# EAGLE design Nixie Wrist Clock V1 (EAGLE 9.5.1)

## Sheet 1 of 5
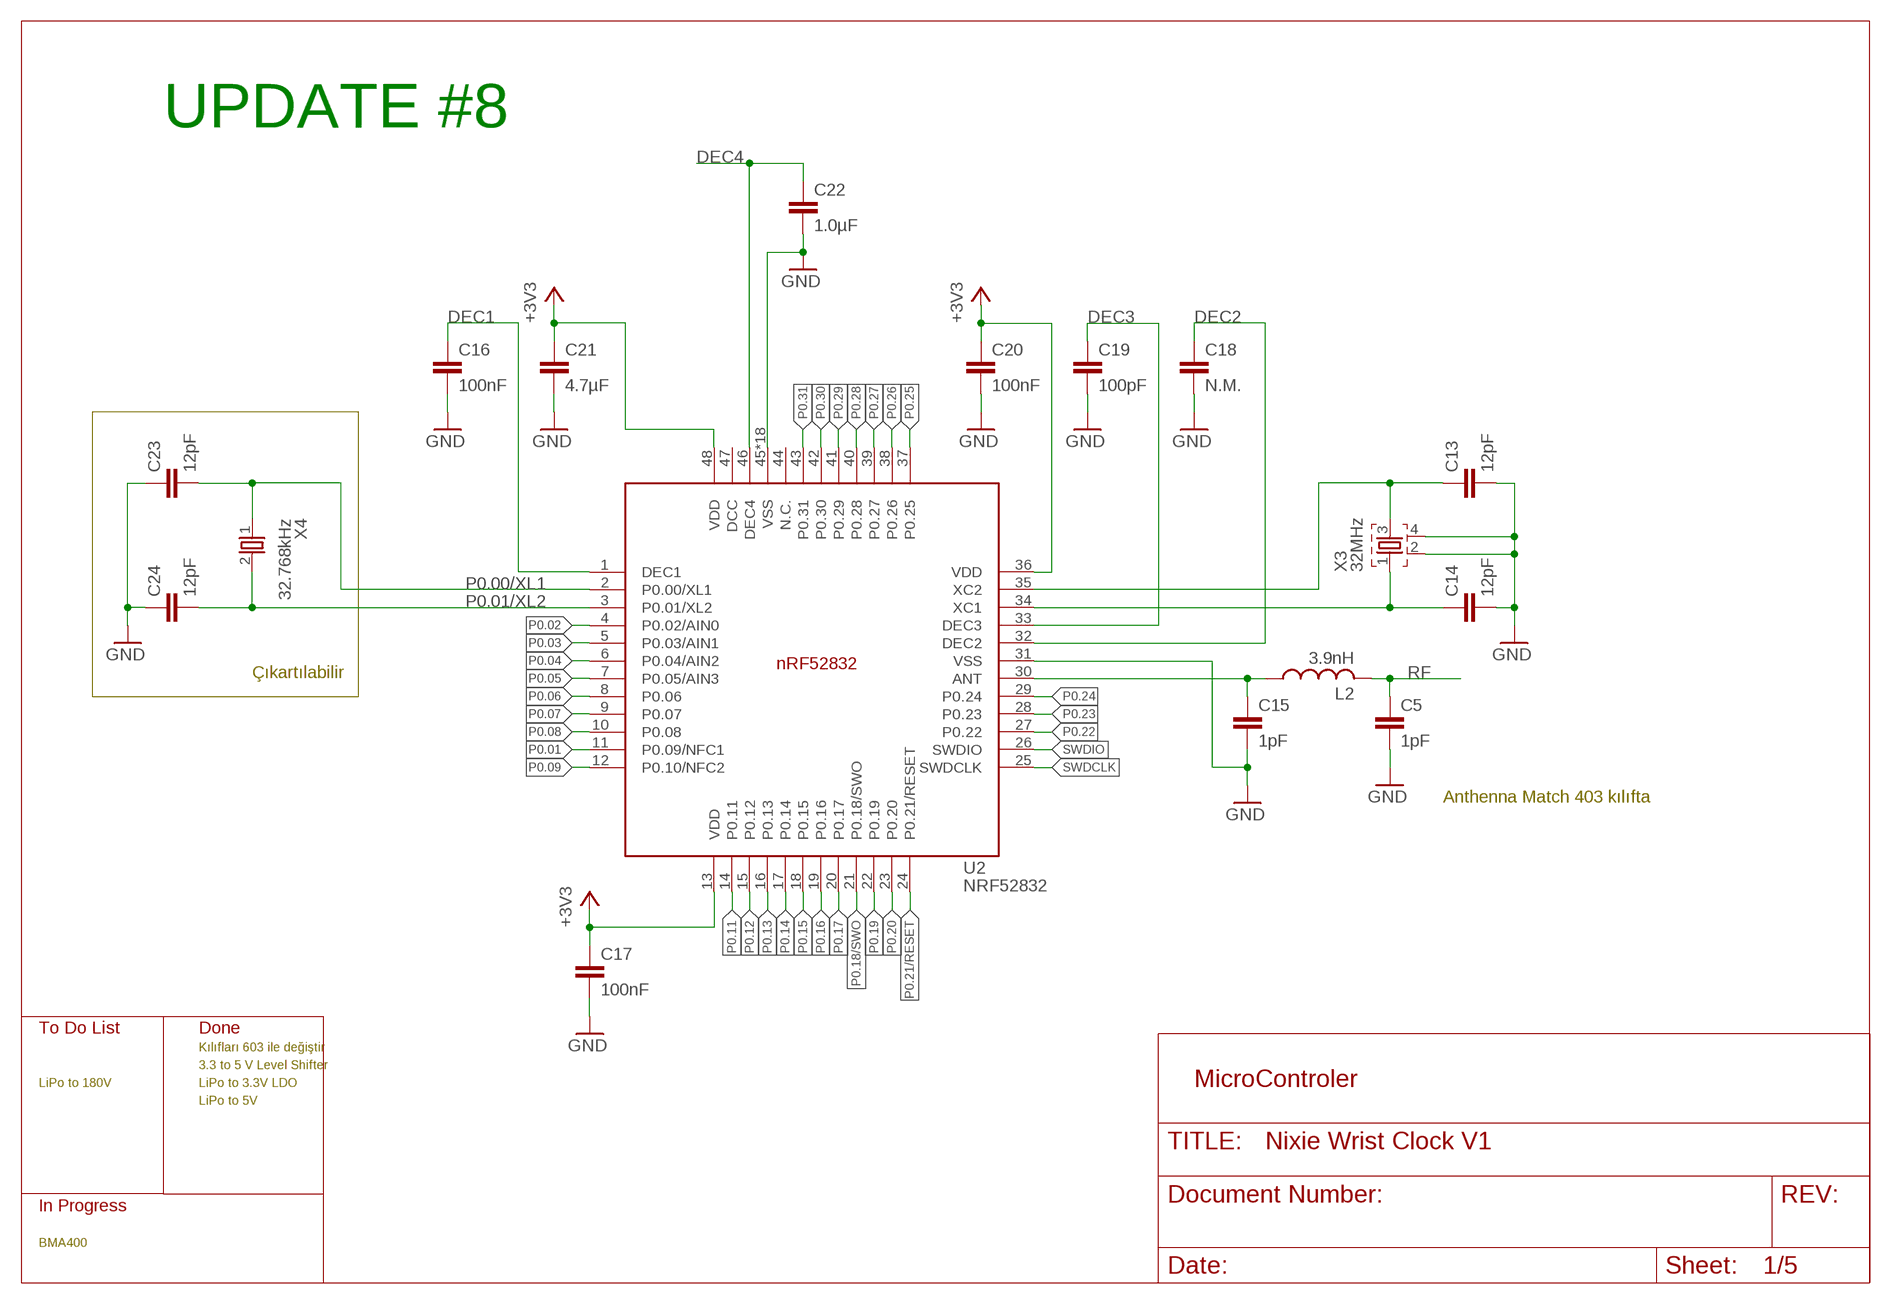
[diagram p0: schematic, sheet 1]

### Parts
C5  1pF  CAPACITOR_0402_N  [RESC0402_N]
C13  12pF  CAPACITOR_0603_N  [RESC0603_N]
C14  12pF  CAPACITOR_0603_N  [RESC0603_N]
C15  1pF  CAPACITOR_0402_N  [RESC0402_N]
C16  100nF  CAPACITOR_0603_N  [RESC0603_N]
C17  100nF  CAPACITOR_0603_N  [RESC0603_N]
C18  N.M.  CAPACITOR_0603_N  [RESC0603_N]
C19  100pF  CAPACITOR_0603_N  [RESC0603_N]
C20  100nF  CAPACITOR_0603_N  [RESC0603_N]
C21  4.7µF  CAPACITOR_0603_N  [RESC0603_N]
C22  1.0µF  CAPACITOR_0603_N  [RESC0603_N]
C23  12pF  CAPACITOR_0603_N  [RESC0603_N]
C24  12pF  CAPACITOR_0603_N  [RESC0603_N]
L2  3.9nH  INDUCTOR_0402_N  [RESC0402_N]
U2  NRF52832  [QFN40P600X600X90-48_N]
X3  32MHz  XTAL_32MHZ  [BT-XTAL_2016_N]
X4  32.768kHz  XTAL_32KHZ  [XTAL_3215_N]

### Nets
+3V3: C17.1 C20.1 C21.1 U2.13(VDD) U2.36(VDD) U2.48(VDD) ; also sheet 2,3,4
ANT1: C15.1 L2.1 U2.30(ANT)
DEC1: C16.1 U2.1(DEC1)
DEC2: C18.1 U2.32(DEC2)
DEC3: C19.1 U2.33(DEC3)
DEC4: C22.1 U2.46(DEC4)
GND: C5.2 C13.2 C14.2 C15.2 C16.2 C17.2 C18.2 C19.2 C20.2 C21.2 C22.2 C23.1 C24.1 U2.31(VSS) U2.45(VSS) U2.PAD(VSS) U2.PAD@VIA01(VSS) U2.PAD@VIA02(VSS) U2.PAD@VIA03(VSS) U2.PAD@VIA04(VSS) U2.PAD@VIA05(VSS) U2.PAD@VIA06(VSS) U2.PAD@VIA07(VSS) U2.PAD@VIA08(VSS) U2.PAD@VIA09(VSS) U2.PAD@VIA10(VSS) U2.PAD@VIA11(VSS) U2.PAD@VIA12(VSS) U2.PAD@VIA13(VSS) U2.PAD@VIA14(VSS) U2.PAD@VIA15(VSS) U2.PAD@VIA16(VSS) X3.2 X3.4 ; also sheet 2,3,4,5
N$1: C13.1 U2.35(XC2) X3.3
P0.00/XL1: C23.2 U2.2(P0.00/XL1) X4.1
P0.01: U2.11(P0.09/NFC1)
P0.01/XL2: C24.2 U2.3(P0.01/XL2) X4.2
P0.02: U2.4(P0.02/AIN0)
P0.03: U2.5(P0.03/AIN1)
P0.04: U2.6(P0.04/AIN2)
P0.05: U2.7(P0.05/AIN3)
P0.06: U2.8(P0.06)
P0.07: U2.9(P0.07)
P0.08: U2.10(P0.08)
P0.09: U2.12(P0.10/NFC2)
P0.11: U2.14(P0.11)
P0.12: U2.15(P0.12)
P0.13: U2.16(P0.13)
P0.14: U2.17(P0.14)
P0.15: U2.18(P0.15)
P0.16: U2.19(P0.16)
P0.17: U2.20(P0.17)
P0.18/SWO: U2.21(P0.18/SWO)
P0.19: U2.22(P0.19)
P0.20: U2.23(P0.20)
P0.21/RESET: U2.24(P0.21/RESET)
P0.22: U2.27(P0.22)
P0.23: U2.28(P0.23)
P0.24: U2.29(P0.24)
P0.25: U2.37(P0.25)
P0.26: U2.38(P0.26)
P0.27: U2.39(P0.27)
P0.28: U2.40(P0.28)
P0.29: U2.41(P0.29)
P0.30: U2.42(P0.30)
P0.31: U2.43(P0.31)
RF: C5.1 L2.2
SWDCLK: U2.25(SWDCLK)
SWDIO: U2.26(SWDIO)
X2: C14.1 U2.34(XC1) X3.1
Unconnected: U2.44(N.C.) U2.47(DCC)

### Notes on the sheet
- UPDATE #8
- Çıkartılabilir
- Anthenna Match 403 kılıfta
- To Do List | Done
- Kılıfları 603 ile değiştir
- 3.3 to 5 V Level Shifter
- LiPo to 180V | LiPo to 3.3V LDO | MicroControler
- LiPo to 5V
- In Progress
- BMA400

## Sheet 2 of 5
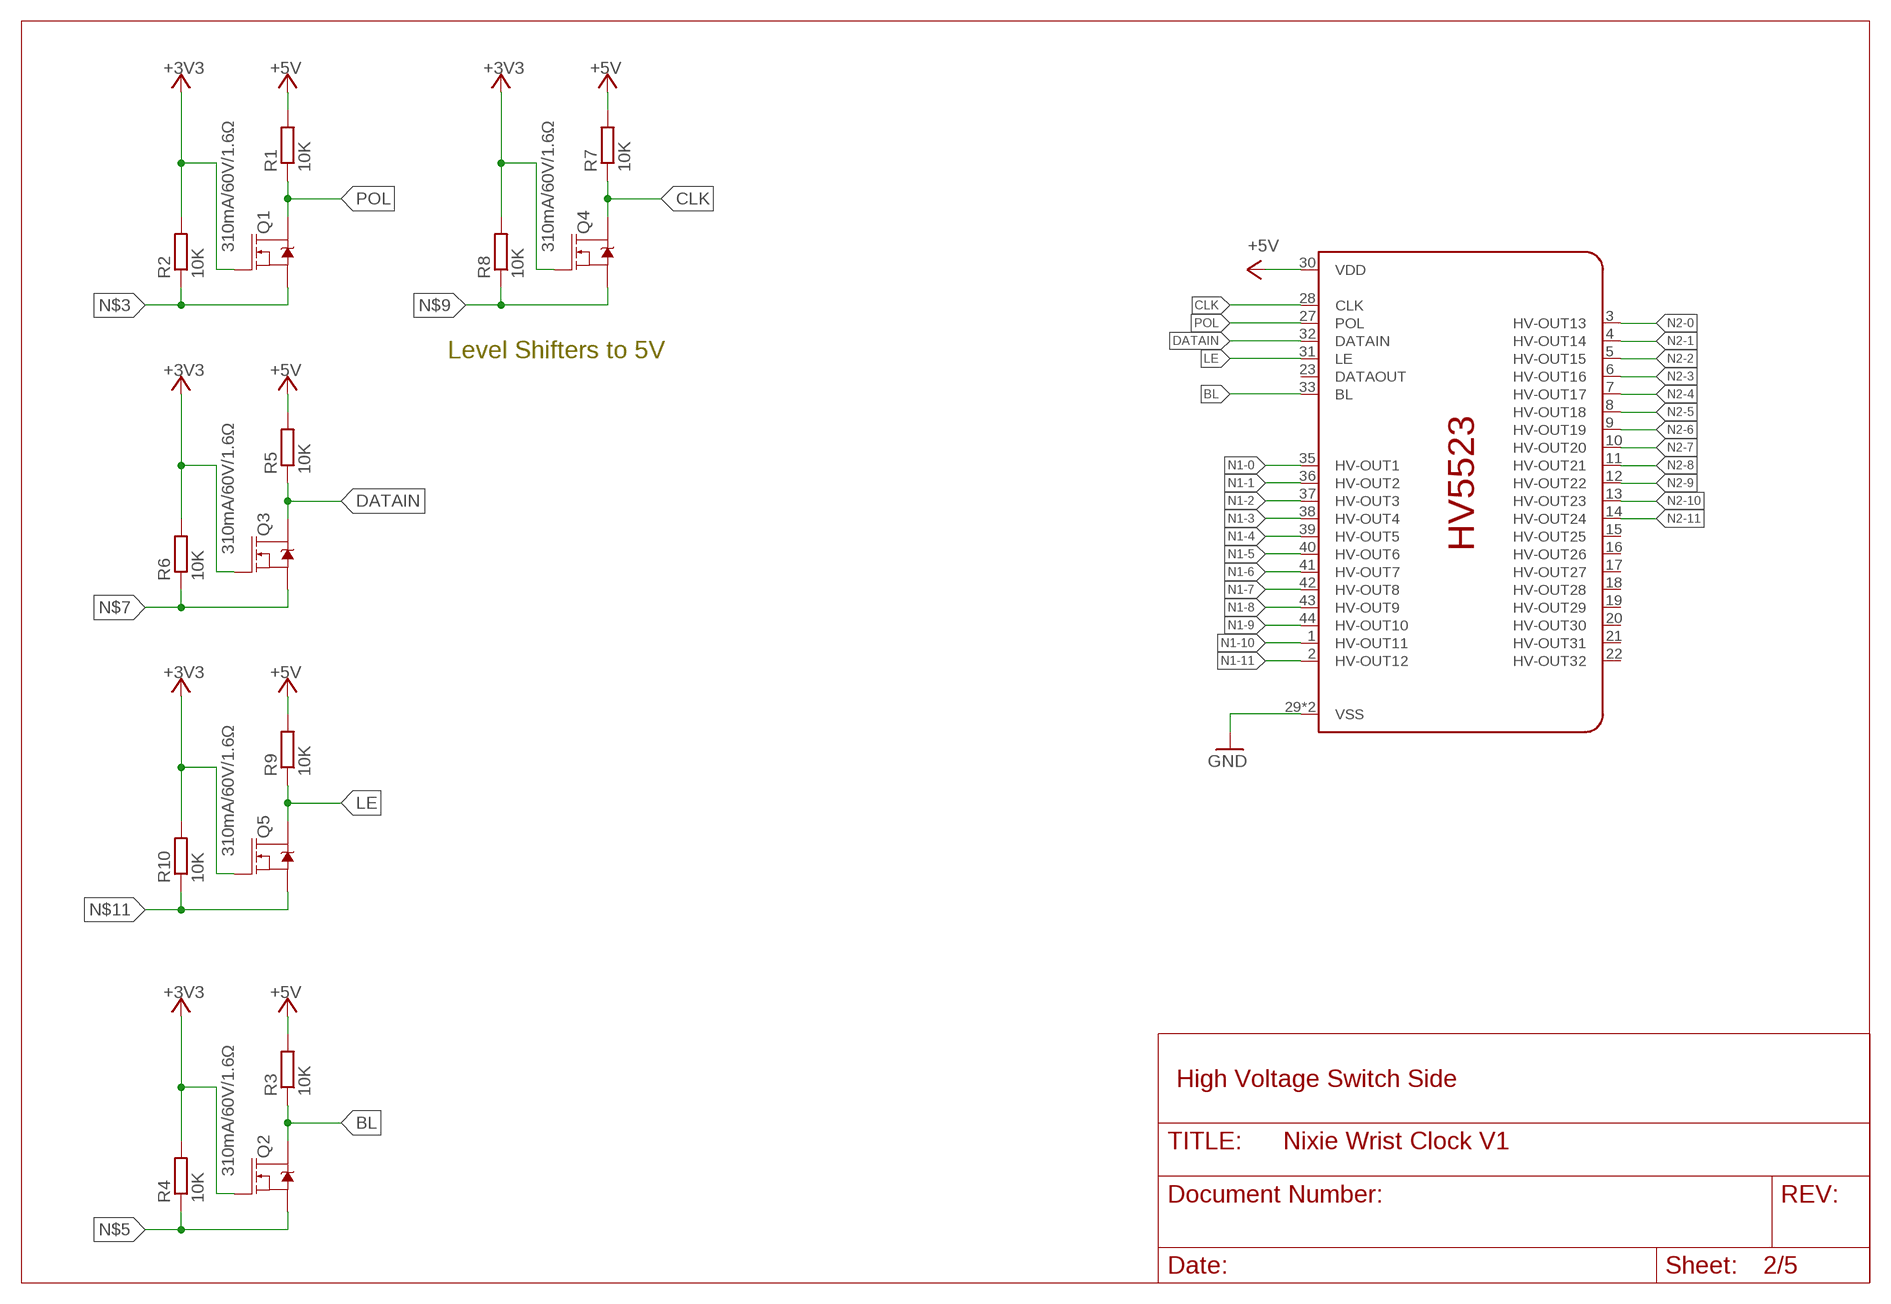
[diagram p1: schematic, sheet 2]

### Parts
Q1  310mA/60V/1.6Ω  MOSFET-NCH-2N7002PW  [SOT323]
Q2  310mA/60V/1.6Ω  MOSFET-NCH-2N7002PW  [SOT323]
Q3  310mA/60V/1.6Ω  MOSFET-NCH-2N7002PW  [SOT323]
Q4  310mA/60V/1.6Ω  MOSFET-NCH-2N7002PW  [SOT323]
Q5  310mA/60V/1.6Ω  MOSFET-NCH-2N7002PW  [SOT323]
R1  10K  R-EU_R0603  [R0603]
R2  10K  R-EU_R0603  [R0603]
R3  10K  R-EU_R0603  [R0603]
R4  10K  R-EU_R0603  [R0603]
R5  10K  R-EU_R0603  [R0603]
R6  10K  R-EU_R0603  [R0603]
R7  10K  R-EU_R0603  [R0603]
R8  10K  R-EU_R0603  [R0603]
R9  10K  R-EU_R0603  [R0603]
R10  10K  R-EU_R0603  [R0603]
U$2  HV5523K7  [QFN50P707X707X80-45T515]

### Nets
+3V3: Q1.1(G) Q2.1(G) Q3.1(G) Q4.1(G) Q5.1(G) R2.2 R4.2 R6.2 R8.2 R10.2 ; also sheet 1,3,4
+5V: R1.2 R3.2 R5.2 R7.2 R9.2 U$2.30(VDD) ; also sheet 5
BL: Q2.3(D) R3.1 U$2.33(BL)
CLK: Q4.3(D) R7.1 U$2.28(CLK)
DATAIN: Q3.3(D) R5.1 U$2.32(DATAIN)
GND: U$2.29(VSS) U$2.45(VSS) ; also sheet 1,3,4,5
LE: Q5.3(D) R9.1 U$2.31(LE)
N1-0: U$2.35(HV-OUT1)
N1-1: U$2.36(HV-OUT2)
N1-2: U$2.37(HV-OUT3)
N1-3: U$2.38(HV-OUT4)
N1-4: U$2.39(HV-OUT5)
N1-5: U$2.40(HV-OUT6)
N1-6: U$2.41(HV-OUT7)
N1-7: U$2.42(HV-OUT8)
N1-8: U$2.43(HV-OUT9)
N1-9: U$2.44(HV-OUT10)
N1-10: U$2.1(HV-OUT11)
N1-11: U$2.2(HV-OUT12)
N2-0: U$2.3(HV-OUT13)
N2-1: U$2.4(HV-OUT14)
N2-2: U$2.5(HV-OUT15)
N2-3: U$2.6(HV-OUT16)
N2-4: U$2.7(HV-OUT17)
N2-5: U$2.8(HV-OUT18)
N2-6: U$2.9(HV-OUT19)
N2-7: U$2.10(HV-OUT20)
N2-8: U$2.11(HV-OUT21)
N2-9: U$2.12(HV-OUT22)
N2-10: U$2.13(HV-OUT23)
N2-11: U$2.14(HV-OUT24)
N$3: Q1.2(S) R2.1
N$5: Q2.2(S) R4.1
N$7: Q3.2(S) R6.1
N$9: Q4.2(S) R8.1
N$11: Q5.2(S) R10.1
POL: Q1.3(D) R1.1 U$2.27(POL)
Unconnected: U$2.15(HV-OUT25) U$2.16(HV-OUT26) U$2.17(HV-OUT27) U$2.18(HV-OUT28) U$2.19(HV-OUT29) U$2.20(HV-OUT30) U$2.21(HV-OUT31) U$2.22(HV-OUT32) U$2.23(DATAOUT)

### Notes on the sheet
- Level Shifters to 5V
- High Voltage Switch Side

## Sheet 3 of 5
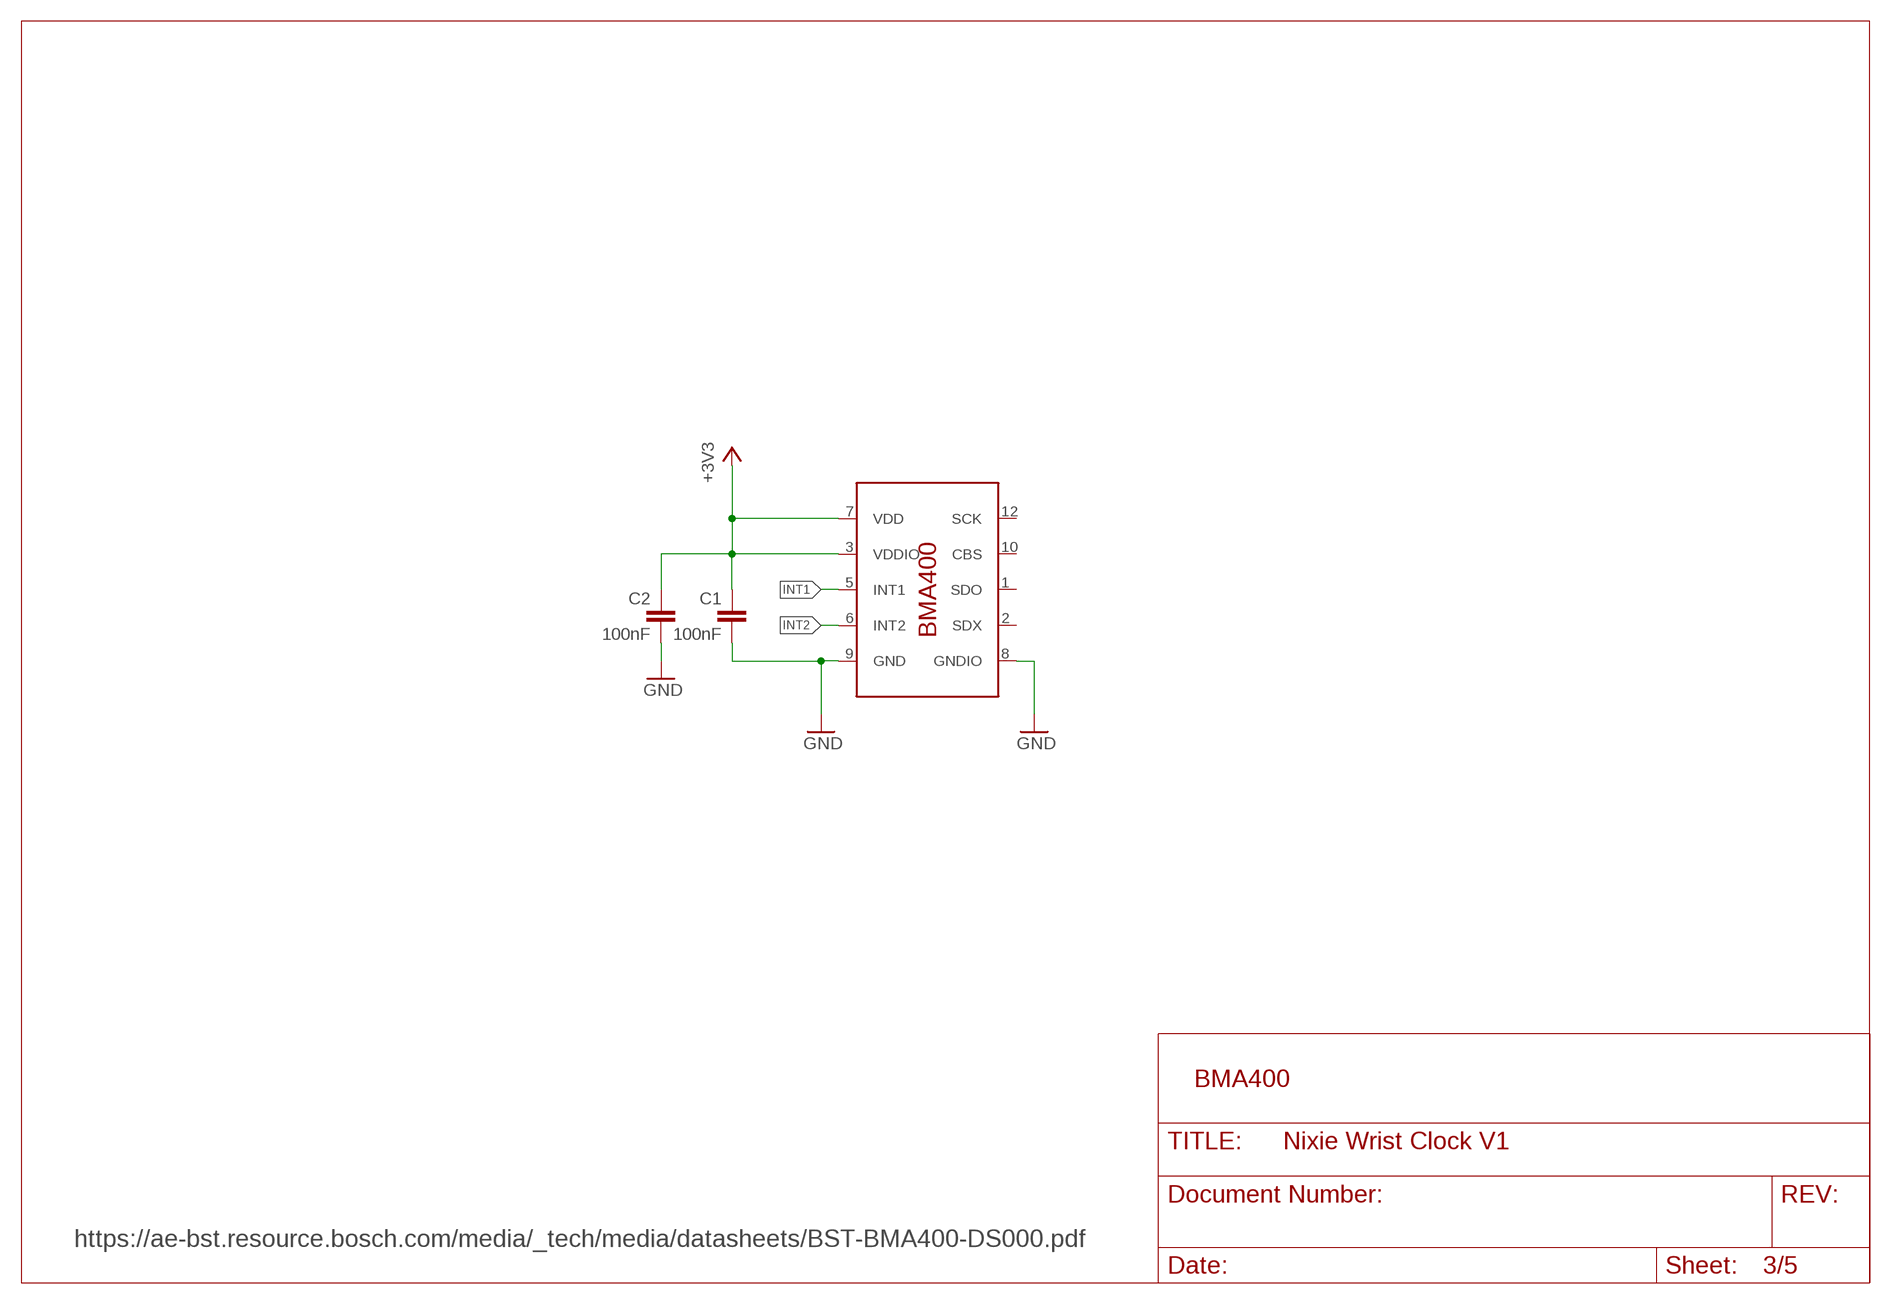
[diagram p2: schematic, sheet 3]

### Parts
C1  100nF  C-EUC0603K  [C0603K]
C2  100nF  C-EUC0603K  [C0603K]
U$1  BMA400  [LGA-12]

### Nets
+3V3: C1.2 C2.1 U$1.3(VDDIO) U$1.7(VDD) ; also sheet 1,2,4
GND: C1.1 C2.2 U$1.8(GNDIO) U$1.9(GND) ; also sheet 1,2,4,5
INT1: U$1.5(INT1)
INT2: U$1.6(INT2)
Unconnected: U$1.1(SDO) U$1.2(SDX) U$1.10(CBS) U$1.12(SCK)

### Notes on the sheet
- BMA400
- https://ae-bst.resource.bosch.com/media/_tech/media/datasheets/BST-BMA400-DS000.pdf

## Sheet 4 of 5
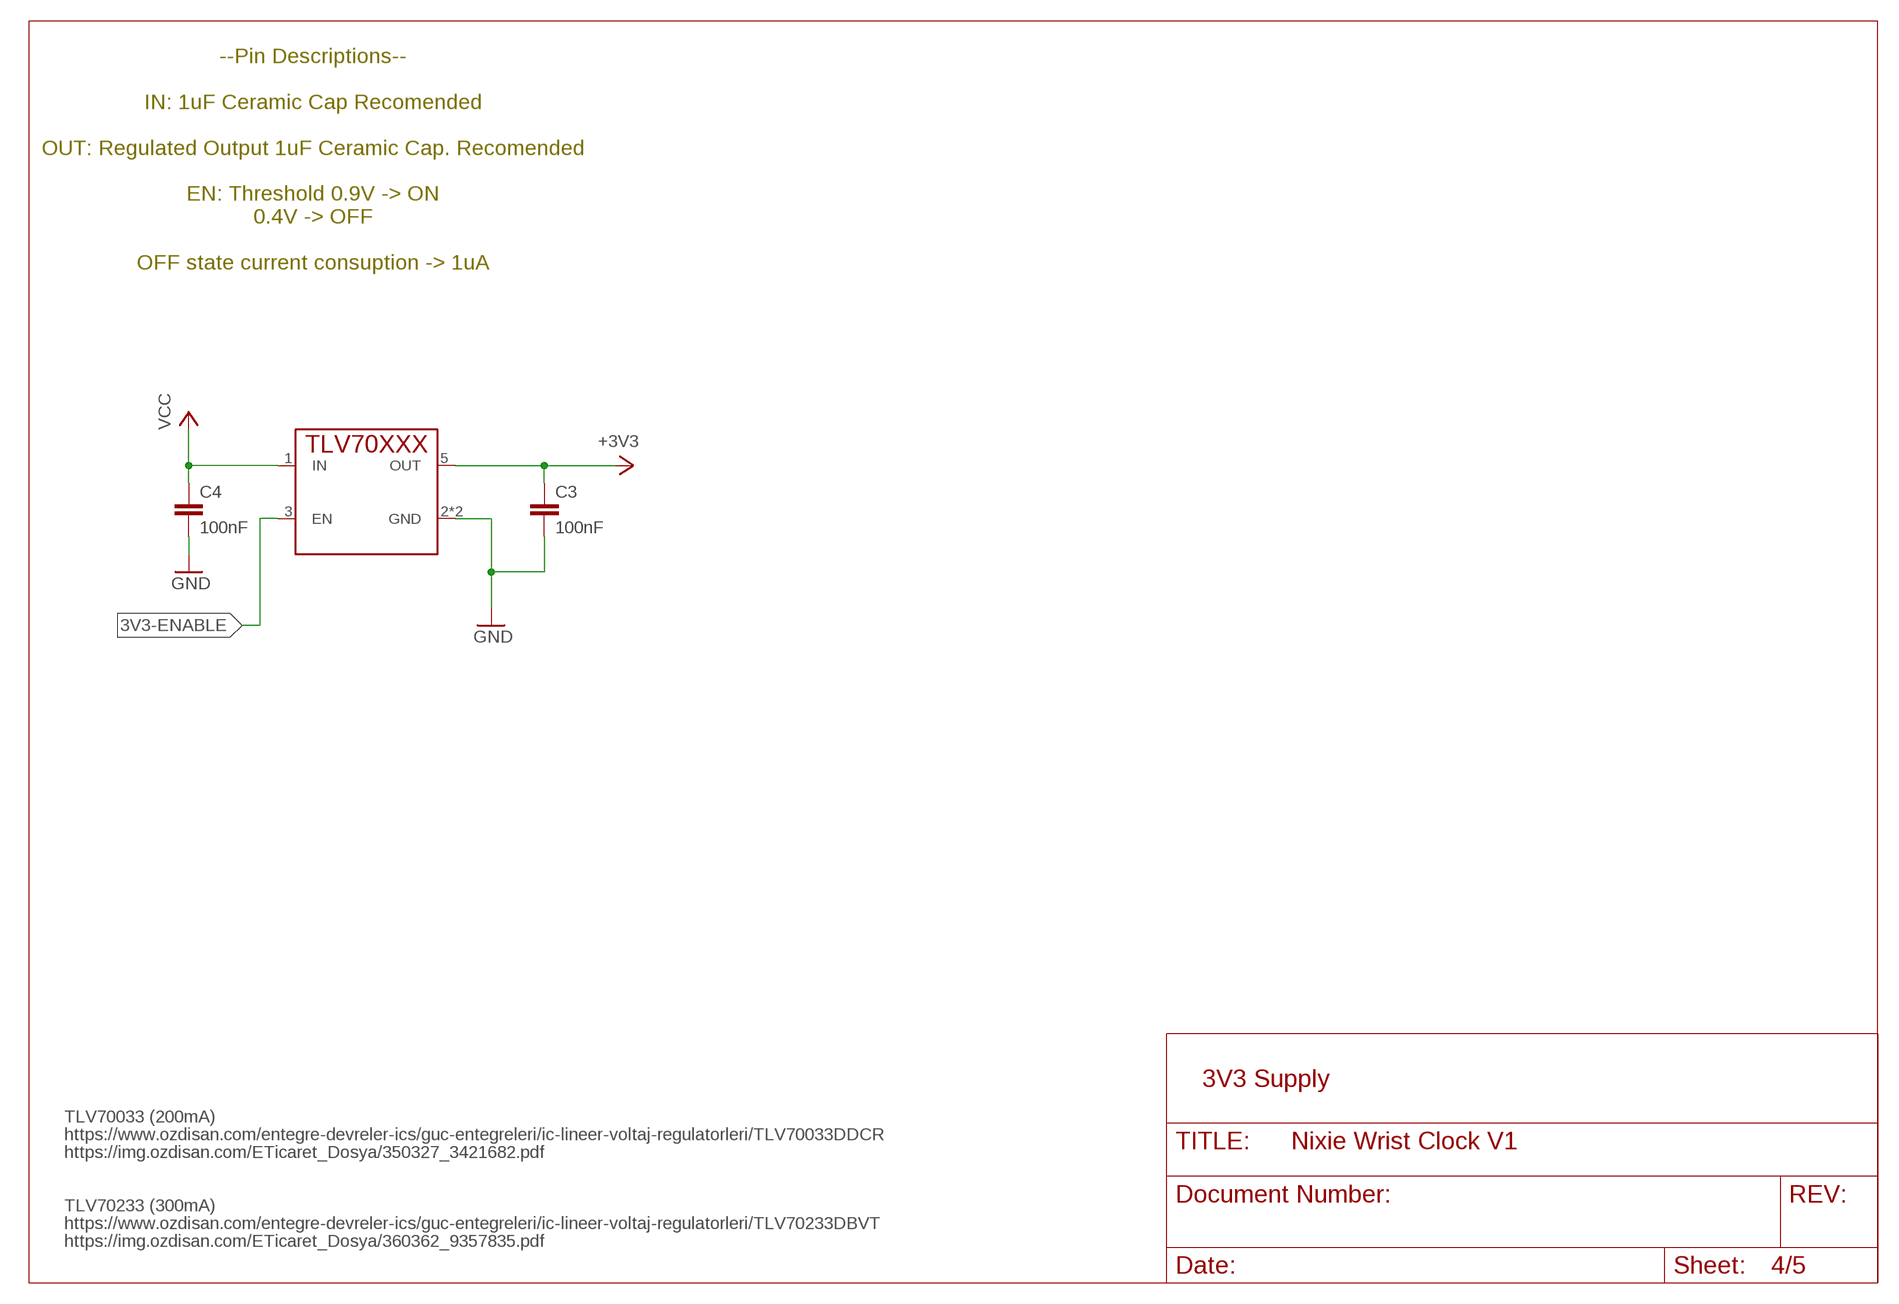
[diagram p3: schematic, sheet 4]

### Parts
C3  100nF  CAPACITOR_0603_N  [RESC0603_N]
C4  100nF  CAPACITOR_0603_N  [RESC0603_N]
U$3  TLV70233SOT23-5  [SOT23-5]

### Nets
3V3-ENABLE: U$3.3(EN)
+3V3: C3.1 U$3.5(OUT) ; also sheet 1,2,3
GND: C3.2 C4.2 U$3.2(GND) U$3.4(GND) ; also sheet 1,2,3,5
VCC: C4.1 U$3.1(IN) ; also sheet 5

### Notes on the sheet
- --Pin Descriptions--
  
  IN: 1uF Ceramic Cap Recomended
  
  OUT: Regulated Output 1uF Ceramic Cap. Recomended
  
  EN: Threshold 0.9V -> ON
  0.4V -> OFF
  
  OFF state current consuption -> 1uA
- 3V3 Supply
- TLV70033 (200mA)
- https://www.ozdisan.com/entegre-devreler-ics/guc-entegreleri/ic-lineer-voltaj-regulatorleri/TLV70033DDCR
- https://img.ozdisan.com/ETicaret_Dosya/350327_3421682.pdf
- TLV70233 (300mA)
- https://www.ozdisan.com/entegre-devreler-ics/guc-entegreleri/ic-lineer-voltaj-regulatorleri/TLV70233DBVT
- https://img.ozdisan.com/ETicaret_Dosya/360362_9357835.pdf

## Sheet 5 of 5
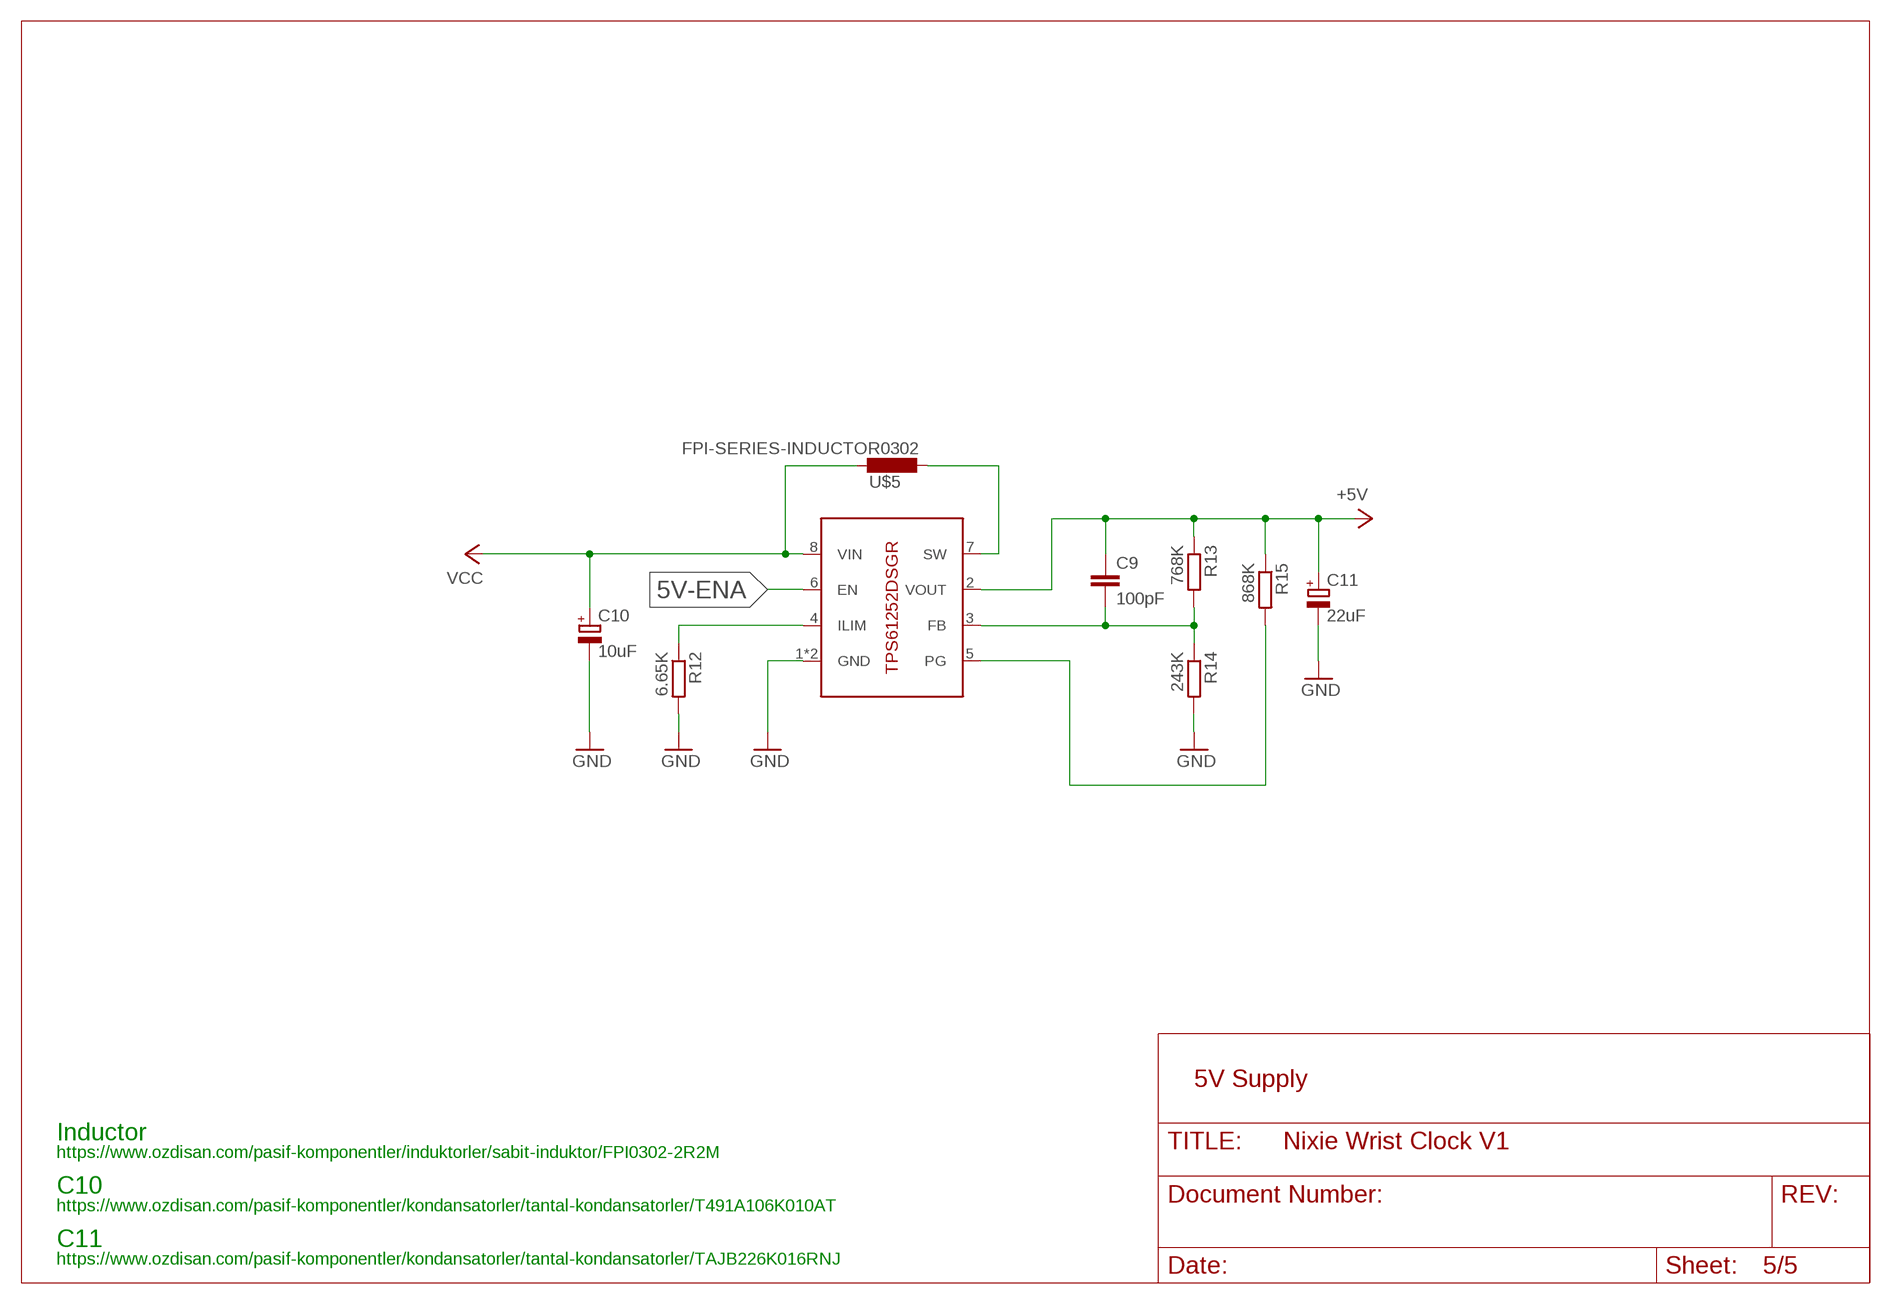
[diagram p4: schematic, sheet 5]

### Parts
C9  100pF  CAPACITOR_0603_N  [RESC0603_N]
C10  10uF  CPOL-EUSMCA  [SMC_A]
C11  22uF  CPOL-EUSMCB  [SMC_B]
R12  6.65K  R-EU_R0603  [R0603]
R13  768K  R-EU_R0603  [R0603]
R14  243K  R-EU_R0603  [R0603]
R15  868K  R-EU_R0603  [R0603]
U$4  TPS61252DSGR  [WSON-8-PAD]
U$5  FPI-SERIES-INDUCTOR0302  [FPI-0302]

### Nets
5V-ENA: U$4.6(EN)
+5V: C9.1 C11.+ R13.1 R15.1 U$4.2(VOUT) ; also sheet 2
GND: C10.- C11.- R12.2 R14.2 U$4.1(GND) U$4.PAD(GND) ; also sheet 1,2,3,4
N$6: U$4.7(SW) U$5.P$2
N$8: R12.1 U$4.4(ILIM)
N$10: R15.2 U$4.5(PG)
N$14: C9.2 R13.2 R14.1 U$4.3(FB)
VCC: C10.+ U$4.8(VIN) U$5.P$1 ; also sheet 4

### Notes on the sheet
- 5V Supply
- Inductor
- https://www.ozdisan.com/pasif-komponentler/induktorler/sabit-induktor/FPI0302-2R2M
- C10
- https://www.ozdisan.com/pasif-komponentler/kondansatorler/tantal-kondansatorler/T491A106K010AT
- C11
- https://www.ozdisan.com/pasif-komponentler/kondansatorler/tantal-kondansatorler/TAJB226K016RNJ

## Library data of the parts
C1 C2 = rcl:C-EU: CAPACITOR, European symbol; SPICEPREFIX: C
C3-C5 C9 C13-C24 = Nordic_nRF:CAPACITOR: Generic chip capacitor
C10 C11 = rcl:CPOL-EU: POLARIZED CAPACITOR, European symbol; SPICEPREFIX: C
L2 = Nordic_nRF:INDUCTOR: Generic chip inductor
Q1-Q5 = SparkFun-DiscreteSemi:MOSFET-NCH: N-channel MOSFETs Voltage controlled devices that allow control of high current outputs. SparkFun Products: SparkFun OpenScale <https://www.sparkfun.com/products/13261> SparkFun Digital Sandbox <https://www.sparkfun.com/products/12651> SparkFun Monster Moto Shield <https://www.sparkfun.com/products/10182> SparkFun MOSFET Power Controller <https://www.sparkfun.com/products/11214>; PROD_ID: TRANS-11151
R1-R10 R12-R15 = rcl:R-EU_: RESISTOR, European symbol; SPICEPREFIX: R
U2 = Nordic_nRF:NRF52832: nRF52832 Features Single chip, highly flexible, 2.4 GHz multi-protocol SoC 32-bit ARM Cortex-M4F Processor 1.7v to 3.6v operation 512kB flash + 64kB RAM Supports concurrent Bluetooth Smart/ANT protocol operation On-chip NFC tag for Out-of-Band (OOB) pairing Up to +4dBm output power -96dBm sensitivity, Bluetooth Smart Thread safe and run-time protected Event driven API On air compatible with nRF24L and nRF24AP series 2 data rates (2Mbps/1Mbps) PPI - maximum flexibility for power-efficient applications and code simplification Automated power management system with automatic power management of each peripheral Configurable I/O mapping for analog and digital I/O 3 x Master/Slave SPI 2 x Two-wire interface (I²C) UART (RTS/CTS) 3 x PWM AES HW encryption Real Time Counter (RTC) Digital microphone interface (PDM) On-chip balun Applications Internet of Things (IoT) Wearables SmartHome sensors Connected white goods Computer peripherals Voice-command smart remotes A4WP ‘Rezence’ wireless charging Beacons Sports and fitness sensors and hubs Connected health products Smart watches RC Toys Interactive games Building automation and sensor networks
U$1 = Alp-Special:BMA400: BMA400 3-Axes Ultra Low Power Accelerometer This accelerometer is Ultra Low Power and Small Footprint 2mm x 2mm LGA 12 pin package. VDD Range = 1.2V - 3.6V Acceleration range 2g/4g/8g/16g Auto-low power / Auto wakeup Activity / In-activity Step Counter ( Overal device current comsuption 4µA ) Activity Recognition ( Walking, Running, Standing Still ) Orientation Detection Tap / Double Tap Digital Interface: SPI (3-Wire, 4-Wire), I2C, 2 Interrupt Pins Digikey Link <https://www.digikey.com/product-detail/en/bosch-sensortec/BMA400/828-1081-1-ND/8634941> Datasheet Link <https://ae-bst.resource.bosch.com/media/_tech/media/datasheets/BST-BMA400-DS000.pdf>
U$2 = Alp-Special:HV5523K7
U$3 = Alp-Special:TLV70233: TLV70233 3.3V LDO Regulator (300mA) Small footprint 3.3V LDO in SOT23-5 package. Özdisan Link <https://www.ozdisan.com/entegre-devreler-ics/guc-entegreleri/ic-lineer-voltaj-regulatorleri/TLV70233DBVT> PDF Link <https://img.ozdisan.com/ETicaret_Dosya/360362_9357835.pdf>
U$4 = Alp-Special:TPS61252DSGR: TPS61252DSGR DC-DC Step-Up Converter with Adjustable VOUT Integrated switch no need for external switching component Adjustable Current Input Limit Small Footprint 8-WSON (2mm x 2mm) Max Current Output: 1.5A Input Voltage Range: 2.3 - 6 V Max Voltage Range: 6.5V Efficiency up to %92 Some Functions to Determine Some Components Value RILIM = (1 / ILIM) x 10.000 IOUT(max) = ILIM x (VIN x η / VOUT) η is efficiency of the system generally above %80 (Datasheet figure.1)
U$5 = Alp-Special:FPI-SERIES-INDUCTOR: FRI0 Series Inductors SMD Inductors Ranging from 680uH to 1uH Foot Prints Available: 3.3mm x 3mm to 7.8mm X 7mm All FRI0 Series Inductors : Özdisan Link <https://www.ozdisan.com/Product/Index/sabit-induktor-903?SearchText=FPI0>
X3 = Nordic_nRF:XTAL_32MHZ
X4 = Nordic_nRF:XTAL_32KHZ

## Board
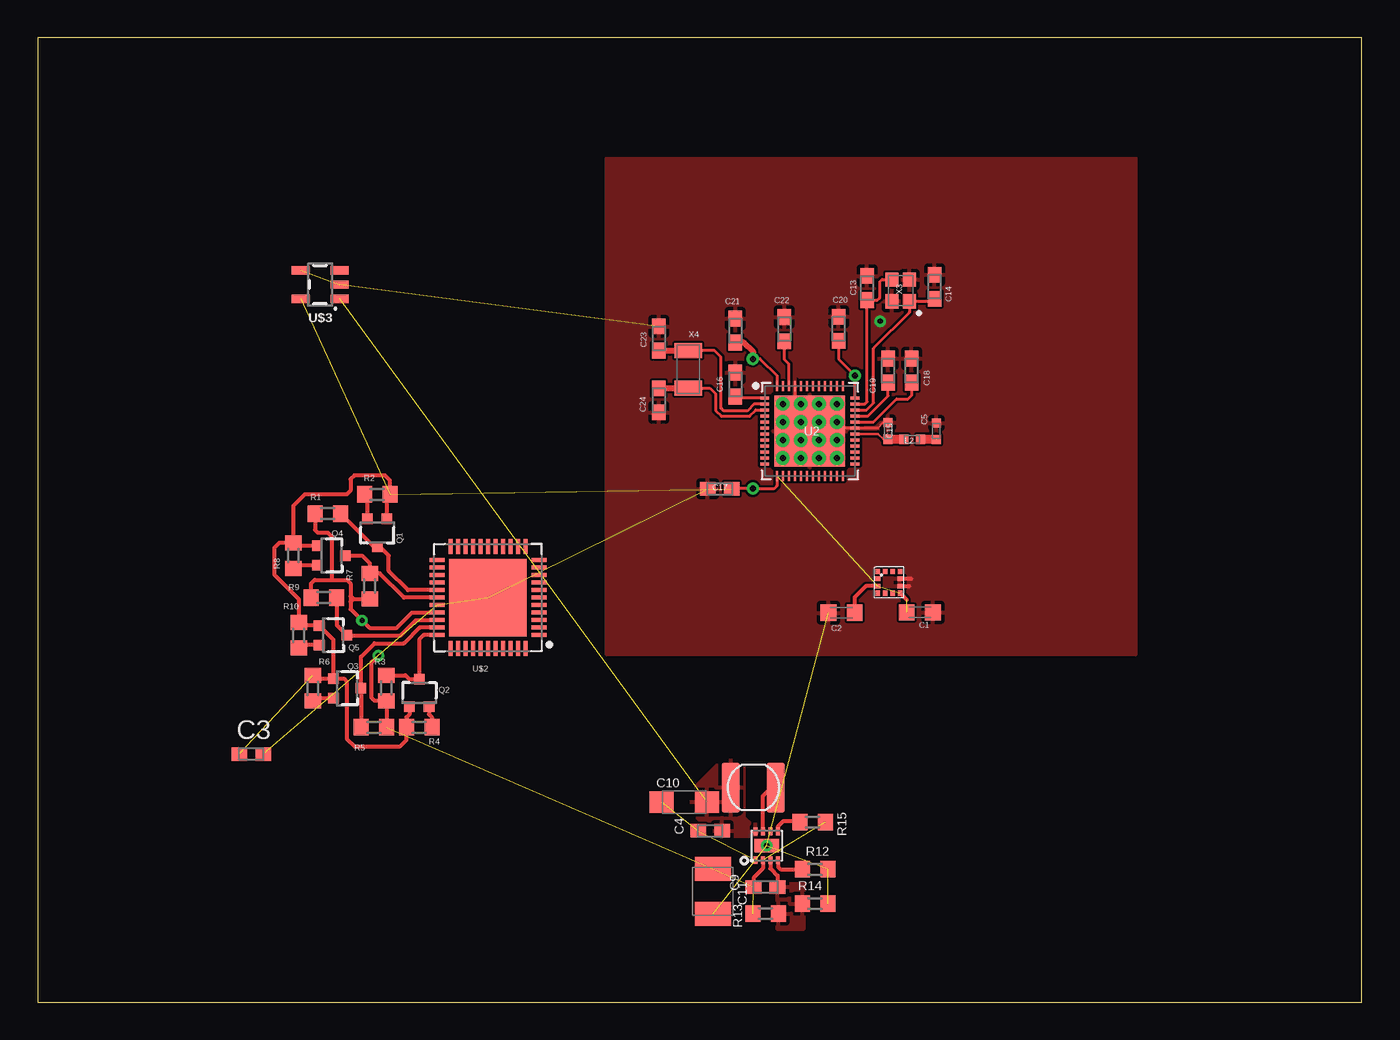
[diagram p5: board, top side]
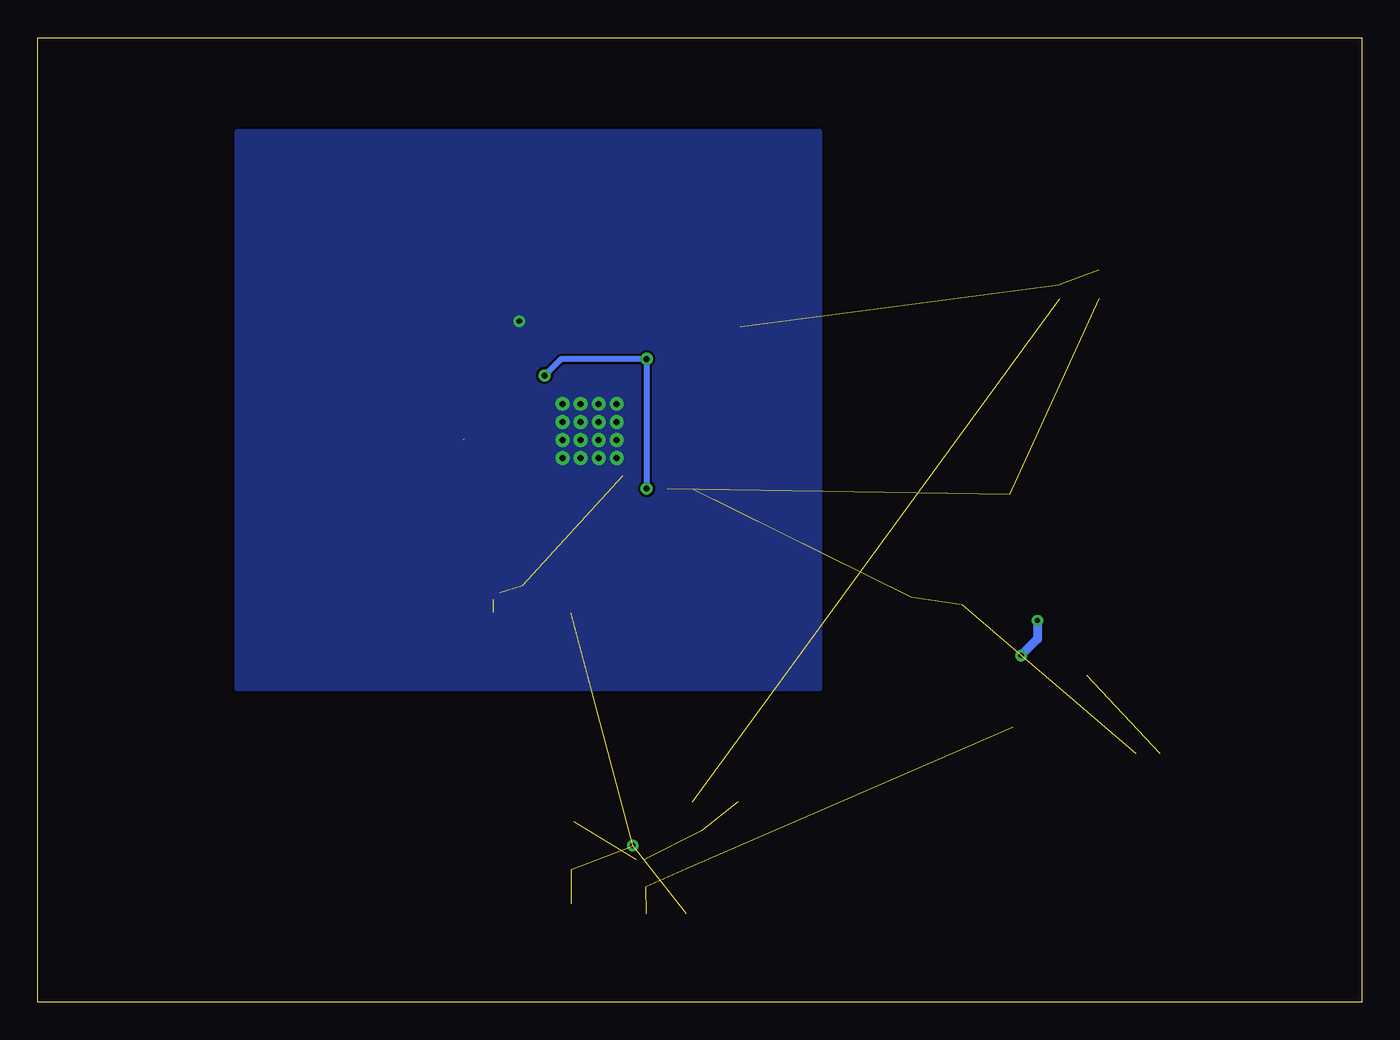
[diagram p6: board, bottom side, seen from below]

Size 88.12 x 64.19 mm. Coordinates in mm from the lower left corner, seen from the top.
Outline: 0,0 88.12,0 88.12,64.19 0,64.19 0,0
Copper layers (1*16): Top 0.035mm / dielectric 1.5mm / Bottom 0.035mm
Design rules "default": minimum track width 6mil, minimum drill 0.35mm, track to track 6mil, track to pad 6mil, pad to pad 6mil, via to via 6mil, smd to smd 6mil, copper to edge 40mil, drill to drill 6mil, minimum pad ring 10mil, minimum via ring 8mil, stop-mask expansion 4mil, vias tented up to drill 0mil, thermal gap 10mil

### Footprints (pad centres in the part's own frame; a part is rotated, then mirrored left to right if it is on the bottom)
C0603K = smd 1.05 x 1.08: 1 -0.875,0; 2 0.875,0
RESC0603_N = smd 1.05 x 0.9: 1 -0.8,0; 2 0.8,0
RESC0402_N = smd 0.6 x 0.6: 1 -0.55,0; 2 0.55,0
SMC_A = smd 1.6 x 1.4: + -1.5,0; - 1.5,0
SMC_B = smd 1.6 x 2.4: + -1.5,0; - 1.5,0
SOT323 = smd 0.7 x 0.7: 1 -0.65,-0.925; 2 0.65,-0.925; 3 0,0.925
R0603 = smd 1 x 1.1: 1 -0.85,0; 2 0.85,0
QFN40P600X600X90-48_N = smd 0.65 x 0.2: 1 -3,2.2; 2 -3,1.8; 3 -3,1.4; 4 -3,1; 5 -3,0.6; 6 -3,0.2; 7 -3,-0.2; 8 -3,-0.6; 9 -3,-1; 10 -3,-1.4; 11 -3,-1.8; 12 -3,-2.2; 25 3,-2.2; 26 3,-1.8; 27 3,-1.4; 28 3,-1; 29 3,-0.6; 30 3,-0.2; 31 3,0.2; 32 3,0.6; 33 3,1; 34 3,1.4; 35 3,1.8; 36 3,2.2 | smd 0.2 x 0.65: 13 -2.2,-3; 14 -1.8,-3; 15 -1.4,-3; 16 -1,-3; 17 -0.6,-3; 18 -0.2,-3; 19 0.2,-3; 20 0.6,-3; 21 1,-3; 22 1.4,-3; 23 1.8,-3; 24 2.2,-3; 37 2.2,3; 38 1.8,3; 39 1.4,3; 40 1,3; 41 0.6,3; 42 0.2,3; 43 -0.2,3; 44 -0.6,3; 45 -1,3; 46 -1.4,3; 47 -1.8,3; 48 -2.2,3 | smd 4.7 x 4.7: PAD 0,0 | drill 0.4: PAD@VIA01 -1.8,1.8; PAD@VIA02 -1.8,0.6; PAD@VIA03 -1.8,-0.6; PAD@VIA04 -1.8,-1.8; PAD@VIA05 -0.6,1.8; PAD@VIA06 -0.6,0.6; PAD@VIA07 -0.6,-0.6; PAD@VIA08 -0.6,-1.8; PAD@VIA09 0.6,1.8; PAD@VIA10 0.6,0.6; PAD@VIA11 0.6,-0.6; PAD@VIA12 0.6,-1.8; PAD@VIA13 1.8,1.8; PAD@VIA14 1.8,0.6; PAD@VIA15 1.8,-0.6; PAD@VIA16 1.8,-1.8
LGA-12 = smd 0.3 x 0.35: 1 -0.75,0.725; 4 -0.75,-0.725; 5 -0.25,-0.725; 6 0.25,-0.725; 7 0.75,-0.725; 10 0.75,0.725; 11 0.25,0.725; 12 -0.25,0.725 | smd 0.35 x 0.3: 2 -0.75,0.25; 3 -0.75,-0.25; 8 0.75,-0.25; 9 0.75,0.25
QFN50P707X707X80-45T515 = smd 0.996 x 0.264: 1 -3.396,2.5; 2 -3.396,2; 3 -3.396,1.5; 4 -3.396,1; 5 -3.396,0.5; 6 -3.396,0; 7 -3.396,-0.5; 8 -3.396,-1; 9 -3.396,-1.5; 10 -3.396,-2; 11 -3.396,-2.5; 23 3.396,-2.5; 24 3.396,-2; 25 3.396,-1.5; 26 3.396,-1; 27 3.396,-0.5; 28 3.396,0; 29 3.396,0.5; 30 3.396,1; 31 3.396,1.5; 32 3.396,2; 33 3.396,2.5 | smd 0.264 x 0.996: 12 -2.5,-3.396; 13 -2,-3.396; 14 -1.5,-3.396; 15 -1,-3.396; 16 -0.5,-3.396; 17 0,-3.396; 18 0.5,-3.396; 19 1,-3.396; 20 1.5,-3.396; 21 2,-3.396; 22 2.5,-3.396; 34 2.5,3.396; 35 2,3.396; 36 1.5,3.396; 37 1,3.396; 38 0.5,3.396; 39 0,3.396; 40 -0.5,3.396; 41 -1,3.396; 42 -1.5,3.396; 43 -2,3.396; 44 -2.5,3.396 | smd 5.15 x 5.15: 45 0,0
SOT23-5 = smd 0.55 x 1.2: 1 -0.95,-1.3; 2 0,-1.3; 3 0.95,-1.3; 4 0.95,1.3; 5 -0.95,1.3
WSON-8-PAD = smd 0.25 x 0.5: 1 -0.75,-0.95; 2 -0.25,-0.95; 3 0.25,-0.95; 4 0.75,-0.95; 5 0.75,0.95; 6 0.25,0.95; 7 -0.25,0.95; 8 -0.75,0.95 | smd 1.6 x 0.9: PAD 0,0
FPI-0302 = smd 3.3 x 1.2: P$1 0,-1.5; P$2 0,1.5
BT-XTAL_2016_N = smd 0.95 x 0.85: 1 -0.725,-0.575; 2 0.725,-0.575; 3 0.725,0.575; 4 -0.725,0.575
XTAL_3215_N = smd 1 x 1.8: 1 -1.25,0; 2 1.25,0

### Placement (x,y rotation side)
C1  58.7,25.93 180 top
C2  53.49,25.91 180 top
C3  14.22,16.51 0 top
C4  44.75,11.4 180 top
C5  59.79,38 90 top
C9  48.44,7.67 0 top
C10  43.03,13.31 180 top
C11  44.93,7.37 270 top
C13  55.19,47.52 90 top
C14  59.69,47.6 90 top
C15  56.59,38 90 top
C16  46.42,41.1 90 top
C17  45.39,34.16 180 top
C18  58.15,42.02 90 top
C19  56.59,42.02 90 top
C20  53.3,44.8 90 top
C21  46.43,44.68 90 top
C22  49.69,44.78 90 top
C23  41.34,44.17 270 top
C24  41.34,40.05 90 top
L2  58.19,37.45 0 top
Q1  22.61,31.24 180 top
Q2  25.4,20.57 0 top
Q3  20.6,20.88 270 top
Q4  19.56,29.72 270 top
Q5  19.66,24.41 270 top
R1  19.3,32.51 180 top
R2  22.61,33.78 0 top
R3  23.22,20.9 270 top
R4  25.4,18.29 180 top
R5  22.38,18.29 0 top
R6  18.31,20.88 90 top
R7  22.1,27.69 270 top
R8  17.02,29.72 90 top
R9  19.05,26.92 180 top
R10  17.37,24.41 90 top
R12  51.74,8.84 0 top
R13  48.44,5.89 0 top
R14  51.74,6.55 0 top
R15  51.56,11.99 180 top
U2  51.39,38 0 top
U$1  56.64,27.94 0 top
U$2  29.97,26.92 180 top
U$3  18.8,47.75 90 top
U$4  48.51,10.41 0 top
U$5  47.62,14.27 270 top
X3  57.43,47.36 90 top
X4  43.29,42.11 270 top

### Tracks (layer width: path | path; a pad name or v marks a point on that pad's centre or on a via)
+3V3  (via drill 0.4 pad 0.8)  (6 unrouted)
  Top 0.203: U2.36 v54.39,41.7 53.3,42.79 C20.1 | 47.58,34.16 48.99,34.16 49.19,34.35 U2.13 | v47.59,42.8 48.08,42.8 49.19,41.7 U2.48 | v47.59,34.17 46.2,34.17 C17.1
  Top 0.254: Q2.1 24.75,19.16 24.55,18.96 R4.2 24.55,17.44 24.13,17.02 21.08,17.02 20.57,17.53 20.57,21.34 20.38,21.53 Q3.1 | R6.2 18.51,21.53 Q3.1 | Q4.1 17.22,30.37 R8.2 | Q1.1 23.26,33.58 R2.2 23.46,34.71 23.11,35.05 21.08,35.05 20.83,34.8 20.83,34.04 20.57,33.78 17.78,33.78 17.02,33.02 R8.2 | Q3.1 19.67,24.12 Q5.1 17.57,25.06 R10.2 17.37,26.82 15.75,28.45 15.75,30.23 16.09,30.57 R8.2 | U$1.3 55.12,27.69 54.37,26.93 C2.1 54.39,25.93 | U$1.7 57.82,26.78
  Top 0.406: v47.59,42.8 47.59,43.31 47.02,43.88 C21.1 | 47.58,34.16 v47.59,34.17
  Bottom 0.4: v47.59,34.17 v47.59,34.18 v47.59,42.8 53.29,42.8 v54.39,41.7
+5V  (via drill 0.35)  (4 unrouted)
  Top 0.254: R5.2 R3.2 22.41,20.05 22.23,20.24 22.23,22.61 v22.68,23.06 | R9.2 18.2,27.85 18.44,28.09 19.56,28.09 | 19.56,28.09 20.6,28.09 20.83,27.86 20.83,27.03 | 20.83,27.03 21.02,26.84 | 21.02,26.84 R7.2 | 20.83,27.03 20.83,26.64 | 20.83,26.64 20.83,26.16 v21.59,25.4 22.08,24.91 23.89,24.91 24.91,25.92 U$2.30 | 21.02,26.84 21.02,26.83 20.83,26.64 | R1.2 18.45,31.43 18.64,31.24 19.3,31.24 19.56,30.99 19.56,28.09 | U$4.2 48.26,8.89 47.64,8.27 C9.1
  Bottom 0.61: v21.59,25.4 21.59,24.16 v22.68,23.06
ANT1
  Top 0.152: U2.30 55.92,37.8 56.27,37.45 C15.1
  Top 0.61: C15.1 L2.1
BL
  Top 0.254: 23.29,21.75 R3.1 24.47,21.75 24.73,21.5 Q2.3 25.4,24.13 25.69,24.42 U$2.33
CLK
  Top 0.254: 22.52,28.54 R7.1 | Q4.3 21.59,29.72 22.1,29.21 R7.1 | U$2.28 24.38,26.92 22.77,28.54 R7.1
DATAIN
  Top 0.254: Q3.3 21.52,21.11 | Q3.3 R5.1 | Q3.3 21.52,22.98 22.42,23.88 24.38,23.88 25.43,24.92 U$2.32
DEC1
  Top 0.2: 46.37,40.28 C16.1
  Top 0.203: U2.1 46.43,40.2 C16.1
DEC2
  Top 0.203: C18.1 58.17,41.2 58.17,40.39 57.91,40.13 57.15,40.13 55.62,38.6 U2.32
DEC3
  Top 0.203: U2.33 55.26,39 56.59,40.33 C19.1
DEC4
  Top 0.203: U2.46 49.99,42.47 49.69,42.77 C22.1
GND  (via drill 0.35)  (12 unrouted)
  Top 0.152: C15.2 56.26,38.55 55.91,38.2 U2.31
  Top 0.2: U2.31 53.24,38.19 | 53.24,38.19 arc-90 U2.PAD@VIA14 | 50.44,39.99 arc90 U2.PAD@VIA05 | U2.PAD@VIA01 50.39,39.8 | 50.39,39.8 U2.PAD@VIA05 | U2.PAD@VIA05 U2.PAD@VIA09 U2.PAD@VIA13 U2.PAD@VIA14 | U2.PAD@VIA02 U2.PAD@VIA06 | U2.PAD@VIA06 U2.PAD@VIA10 U2.PAD@VIA14 | 53.24,38.19 53.24,37.79 arc-90 U2.PAD@VIA15 | U2.PAD@VIA15 U2.PAD@VIA16 U2.PAD@VIA12 | U2.PAD@VIA15 U2.PAD@VIA11 U2.PAD@VIA07 U2.PAD@VIA03 U2.PAD@VIA04 U2.PAD@VIA08 | U2.PAD@VIA06 arc90 U2.PAD | U2.45 50.39,39.8
  Top 0.254: U$1.8 57.99,27.69 | U$1.9 58.14,28.19
  other vias: 56.06,45.31 48.51,10.41
  pour Top: 37.85,23.11 37.85,56.16 73.09,56.16 73.09,23.11
  pour Bottom: 36.07,20.83 36.07,57.94 74.86,57.94 74.86,20.83
LE
  Top 0.254: R9.1 19.9,25.09 Q5.3 | Q5.3 | U$2.31 25.17,25.42 24.16,24.41 Q5.3
N$1
  Top 0.203: U2.35 55.04,39.8 55.19,39.95 C13.1 55.89,46.72 56.03,46.86 56.03,47.93 56.19,48.09 X3.3 56.55,48.09
N$3
  Top 0.254: Q1.2 21.96,33.58 R2.1
N$5
  Top 0.254: Q2.2 26.05,19.16 26.25,18.96 R4.1
N$6
  Top 0.254: U$4.7 48.26,13.72 48.82,14.28 U$5.P$2
N$7
  Top 0.254: R6.1 18.51,20.23 Q3.2
N$8
  Top 0.254: U$4.4 49.26,9 49.43,8.84 R12.1
N$9
  Top 0.254: Q4.2 17.22,29.07 R8.1
N$10
  Top 0.254: U$4.5 49.26,11.7 49.58,12.01 50.32,12.01 50.34,11.99 R15.2
N$11
  Top 0.254: Q5.2 17.57,23.76 R10.1
N$14
  Top 0.254: U$4.3 48.76,8.89 49.24,8.42 C9.2
  Top 0.61: 49.24,5.94 R13.2
  pour Top: 49.2,7.85 49.2,4.88 50.98,4.88 50.98,7.85 50.52,7.85
P0.00/XL1
  Top 0.203: U2.2 47.68,39.8 47.22,39.34 45.64,39.34 45.47,39.52 45.47,42.93 45.03,43.37 X4.1
  Top 0.406: C23.2 X4.1
P0.01/XL2
  Top 0.203: X4.2 44.74,40.86 45.11,40.49 45.11,39.37 45.49,38.99 47.37,38.99 47.79,39.4 U2.3
  Top 0.406: C24.2 43.28,40.85 X4.2
POL
  Top 0.254: R1.1 22.35,30.32 Q1.3 22.77,30.32 23.37,29.72 23.37,28.7 24.65,27.42 U$2.27
RF  (1 unrouted)
  Top 0.61: L2.2 59.73,37.45
VCC  (1 unrouted)
  pour Top: 47.9,11 45.11,11 45.03,11.07 45.03,11.86 44.88,12.01 44.07,12.01 43.51,12.57 43.51,14.12 45.49,16.1 46.84,16.1 47.02,15.93 47.02,12.34 47.5,11.86 47.93,11.86 47.93,11.02
X2
  Top 0.203: U2.34 55.15,39.4 55.63,39.88 55.63,43.51 58,45.89 X3.1 59.52,46.63 C14.1